# Altium project CMSPanel.PrjPcb
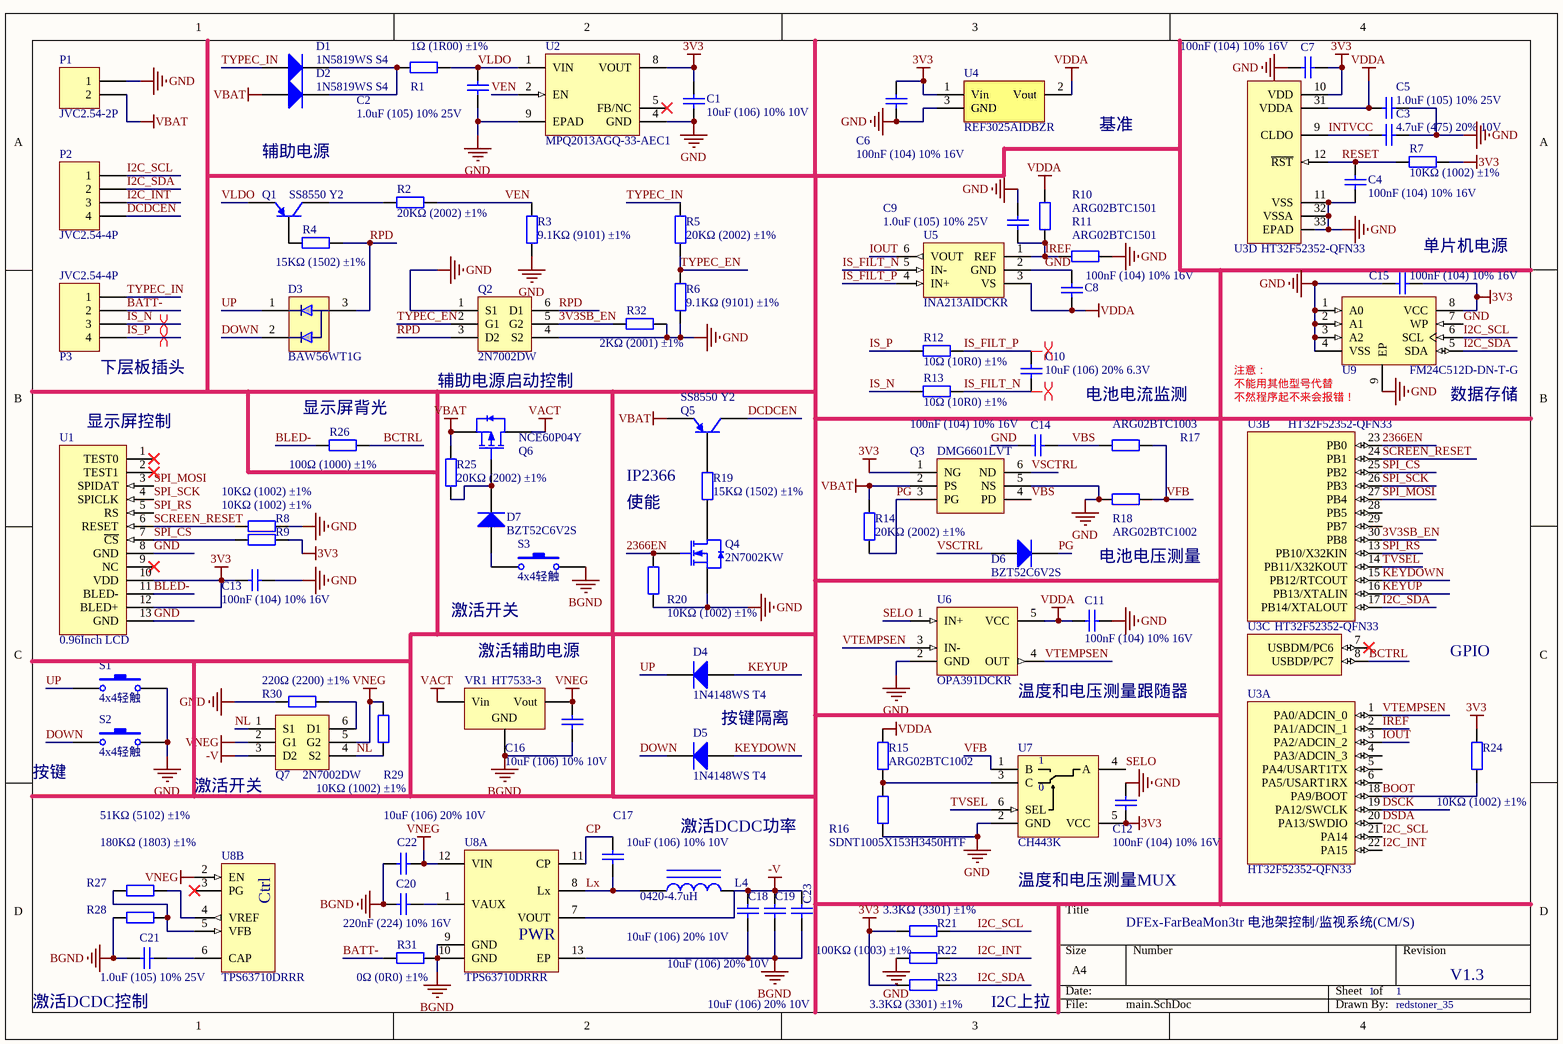
[diagram p0: main.SchDoc]
1 sheet, 86 parts. Net scope: global (net labels, ports and power ports of the same name join across sheets).
Board file: PCB1.PcbDoc

## Sheet main.SchDoc
size A4

### Parts
C1  10uF (106) 10% 10V  [0603_C]
C2  1.0uF (105) 10% 25V  [0402_C]
C3  4.7uF (475) 20% 10V  [0402_C]
C4  100nF (104) 10% 16V  [0402_C]
C5  1.0uF (105) 10% 25V  [0402_C]
C6  100nF (104) 10% 16V  [0402_C]
C7  100nF (104) 10% 16V  [0402_C]
C8  100nF (104) 10% 16V  [0402_C]
C9  1.0uF (105) 10% 25V  [0402_C]
C10  10uF (106) 20% 6.3V  [0402_C]
C11  100nF (104) 10% 16V  [0402_C]
C12  100nF (104) 10% 16V  [0402_C]
C13  100nF (104) 10% 16V  [0402_C]
C14  100nF (104) 10% 16V  [0402_C]
C15  100nF (104) 10% 16V  [0402_C]
C16  10uF (106) 10% 10V  [0603_C]
C17  10uF (106) 10% 10V  [0603_C]
C18  10uF (106) 20% 10V  [0402_C]
C19  10uF (106) 20% 10V  [0402_C]
C20  220nF (224) 10% 16V  [0402_C]
C21  1.0uF (105) 10% 25V  [0402_C]
C22  10uF (106) 20% 10V  [0402_C]
C23  10uF (106) 20% 10V  [0402_C]
D1  1N5819WS S4  [SOD-323]
D2  1N5819WS S4  [SOD-323]
D3  BAW56WT1G  [SC70-3]
D4  1N4148WS T4  [SOD-323]
D5  1N4148WS T4  [SOD-323]
D6  BZT52C6V2S  [SOD-323]
D7  BZT52C6V2S  [SOD-323]
L4  0420-4.7uH  [0420CDMCCDS-***MC]
P1  JVC2.54-2P  [CONN-TH_2P-P2.54_JVC-2.54MM-2P]
P2  JVC2.54-4P  [CONN-TH_4P-P2.54_JVC-2.54MM-4P]
P3  JVC2.54-4P  [CONN-TH_4P-P2.54_JVC-2.54MM-4P]
Q1  SS8550 Y2  [SC70-3]
Q2  2N7002DW  [SC70-6]
Q3  DMG6601LVT  [SOT95P245X110-6N]
Q4  2N7002KW  [SC70-3]
Q5  SS8550 Y2  [SC70-3]
Q6  NCE60P04Y  [SOT-23(SOT-23-3)]
Q7  2N7002DW  [SC70-6]
R1  1Ω (1R00) ±1%  [0402_R]
R2  20KΩ (2002) ±1%  [0402_R]
R3  9.1KΩ (9101) ±1%  [0402_R]
R4  15KΩ (1502) ±1%  [0402_R]
R5  20KΩ (2002) ±1%  [0402_R]
R6  9.1KΩ (9101) ±1%  [0402_R]
R7  10KΩ (1002) ±1%  [0402_R]
R8  10KΩ (1002) ±1%  [0402_R]
R9  10KΩ (1002) ±1%  [0402_R]
R10  ARG02BTC1501  [0402_R]
R11  ARG02BTC1501  [0402_R]
R12  10Ω (10R0) ±1%  [0402_R]
R13  10Ω (10R0) ±1%  [0402_R]
R14  20KΩ (2002) ±1%  [0402_R]
R15  ARG02BTC1002  [0402_R]
R16  SDNT1005X153H3450HTF  [0402_R]
R17  ARG02BTC1003  [0402_R]
R18  ARG02BTC1002  [0402_R]
R19  15KΩ (1502) ±1%  [0402_R]
R20  10KΩ (1002) ±1%  [0402_R]
R21  3.3KΩ (3301) ±1%  [0402_R]
R22  100KΩ (1003) ±1%  [0402_R]
R23  3.3KΩ (3301) ±1%  [0402_R]
R24  10KΩ (1002) ±1%  [0402_R]
R25  20KΩ (2002) ±1%  [0402_R]
R26  100Ω (1000) ±1%  [0402_R]
R27  51KΩ (5102) ±1%  [0402_R]
R28  180KΩ (1803) ±1%  [0402_R]
R29  10KΩ (1002) ±1%  [0402_R]
R30  220Ω (2200) ±1%  [0603_R]
R31  0Ω (0R0) ±1%  [0402_R]
R32  2KΩ (2001) ±1%  [0402_R]
S1  4x4轻触  [SW-SMD_4P-L5.2-W5.2-P3.70-LS6.4]
S2  4x4轻触  [SW-SMD_4P-L5.2-W5.2-P3.70-LS6.4]
S3  4x4轻触  [SW-SMD_4P-L5.2-W5.2-P3.70-LS6.4]
U1  0.96Inch LCD  [0.96"IPS168*80TFT]
U2  MPQ2013AGQ-33-AEC1  [MPQ2013A-QFN8]
U3  HT32F52352-QFN33  [QFN32-HT32]  (parts A,B,C,D of 4)
U4  REF3025AIDBZR  [SOT-23_N]
U5  INA213AIDCKR  [SC70-6]
U6  OPA391DCKR  [SC70-5]
U7  CH443K  [SC70-6]
U8  TPS63710DRRR  [DR0012C]  (parts A,B of 2)
U9  FM24C512D-DN-T-G  [UDFN-8]
VR1  HT7533-3  [SOT-89(SOT-89-3)]

### Nets
3V3: C1.2 C6.2 C7.2 C12.2 C13.1 C15.2 Q3.1(NG) R7.2 R9.2 R21.1 R23.1 R24.2 U1.10(VDD) U1.12(BLED+) U2.8(VOUT) U3.10(VDD) U4.1(Vin) U7.5(VCC) U9.8(VCC)
-V: C18.2 C19.2 C23.2 L4.2 Q7.3(D2) U8.7(VOUT)
BGND: C16.1 C18.1 C19.1 C20.1 C21.1 C22.1 C23.1 R28.1 R31.2 S3.2 U8.9(GND) U8.10(GND) U8.13(EP) VR1.1(GND)
GND: C1.1 C2.1 C3.2 C4.1 C5.2 C6.1 C7.1 C8.2 C9.2 C11.1 C12.1 C13.2 C14.2 C15.1 P1.1 Q2.1(S1) Q2.4(S2) Q3.5(NS) Q4.2(S) R3.1 R6.1 R8.2 R11.1 R16.1 R18.1 R20.1 R22.1 R30.1 R32.2 S1.2 S2.2 U1.8(GND) U1.13(GND) U2.4(GND) U2.9(EPAD) U3.11(VSS) U3.32(VSSA) U3.33(EPAD) U4.3(GND) U5.2(GND) U6.2(GND) U7.2(GND) U9.1(A0) U9.2(A1) U9.3(A2) U9.4(VSS) U9.7(WP) U9.9(EP)
VACT: Q6.3(D) VR1.2(Vin)
VBAT: D2.1(A) P1.2 Q3.2(PS) Q5.2(E) Q6.2(S) R14.2 R25.2
VDDA: C5.1 C8.1 C11.2 R10.2 R15.2 U3.31(VDDA) U4.2(Vout) U5.3(VS) U6.5(VCC)
VNEG: C16.2 C22.2 Q7.2(G1) Q7.5(G2) R29.2 U8.2(EN) U8.12(VIN) VR1.3(Vout)
3V3SB_EN: Q2.5(G2) R32.1 U3.30(PB8)
2366EN: Q4.1(G) R20.2 U3.23(PB0)
BATT-: P3.2 R31.1
BCTRL: R26.1 U3.8(USBDP/PC7)
BLED-: R26.2 U1.11(BLED-)
BOOT: R24.1 U3.18(PA9/BOOT)
CP: C17.2 U8.11(CP)
DCDCEN: P2.4 Q5.3(C)
DOWN: D3.2(K2) D5.2(K) S2.1
DSCK: U3.19(PA12/SWCLK)
DSDA: U3.20(PA13/SWDIO)
I2C_INT: P2.3 R22.2 U3.22(PA15)
I2C_SCL: P2.1 R21.2 U3.21(PA14) U9.6(SCL)
I2C_SDA: P2.2 R23.2 U3.17(PB14/XTALOUT) U9.5(SDA)
INTVCC: C3.1 U3.9(CLDO)
IOUT: U3.3(PA2/ADCIN_2) U5.6(VOUT)
IREF: C9.1 R10.1 R11.2 U3.2(PA1/ADCIN_1) U5.1(REF)
IS_FILT_N: C10.1 R13.2 U5.5(IN-)
IS_FILT_P: C10.2 R12.2 U5.4(IN+)
IS_N: P3.3 R13.1
IS_P: P3.4 R12.1
KEYDOWN: D5.1(A) U3.15(PB12/RTCOUT)
KEYUP: D4.1(A) U3.16(PB13/XTALIN)
Lx: C17.1 L4.1 U8.8(Lx)
NL: Q7.1(S1) Q7.4(S2) R29.1
PG: D6.2(K) Q3.3(PG) R14.1
RESET: C4.2 R7.1 U3.12(~{RST})
RPD: D3.3(A) Q2.3(D2) Q2.6(D1) R4.2
SCREEN_RESET: R8.1 U1.6(RESET) U3.24(PB1)
SELO: U6.1(IN+) U7.4(A)
SPI_CS: R9.1 U1.7(~{CS}) U3.25(PB2)
SPI_MOSI: U1.3(SPIDAT) U3.27(PB4)
SPI_RS: U1.5(RS) U3.13(PB10/X32KIN)
SPI_SCK: U1.4(SPICLK) U3.26(PB3)
TVSEL: U3.14(PB11/X32KOUT) U7.6(SEL)
TYPEC_EN: Q2.2(G1) R5.1 R6.2
TYPEC_IN: D1.1(A) P3.1 R5.2
UP: D3.1(K1) D4.2(K) S1.1
VBS: C14.1 Q3.4(PD) R17.2
VEN: R2.2 R3.2 U2.2(EN)
VFB: R17.1 R18.2 U7.1(B)
VLDO: C2.2 Q1.2(E) R1.2 U2.1(VIN)
VSCTRL: D6.1(A) Q3.6(ND)
VTEMPSEN: U3.1(PA0/ADCIN_0) U6.3(IN-) U6.4(OUT)
NetC20_2: C20.2 U8.1(VAUX)
NetC21_2: C21.2 U8.6(CAP)
NetD1_2: D1.2(K) D2.2(K) R1.1
NetD7_1: D7.1(A) S3.1
NetD7_2: D7.2(K) Q6.1(G) R25.1
NetQ1_1: Q1.1(B) R4.1
NetQ1_3: Q1.3(C) R2.1
NetQ4_3: Q4.3(D) R19.1
NetQ5_1: Q5.1(B) R19.2
NetQ7_6: Q7.6(D1) R30.2
NetR15_1: R15.1 R16.2 U7.3(C)
NetR27_1: R27.1 R28.2 U8.5(VFB)
NetR27_2: R27.2 U8.4(VREF)

Not connected (* = marked no-connect by the designer): U1 1(TEST0)* 2(TEST1)* 9(NC)*; U2 5(FB/NC)*; U3 4(PA3/ADCIN_3) 5(PA4/USART1TX) 6(PA5/USART1RX) 7(USBDM/PC6)* 28(PB5) 29(PB7); U8 3(PG)*

### Layout directives
differential pair: IS_FILT_N, IS_FILT_P, IS_N, IS_P

### Notes on the sheet
- 辅助电源
- 基准
- (near C15) 单片机电源
- (near P3) 下层板插头
- 辅助电源启动控制
- 注意：
- 不能用其他型号代替
- (near U1) 显示屏控制
- (near R26) 显示屏背光
- 电池电流监测
- 不然程序起不来会报错！
- (near U9) 数据存储
- IP2366
- 使能
- 电池电压测量
- 激活开关
- (near VR1) 激活辅助电源
- GPIO
- 按键隔离
- (near U6) 温度和电压测量跟随器
- 按键
- 激活DCDC功率
- 温度和电压测量MUX
- DFEx-FarBeaMon3tr 电池架控制/监视系统(CM/S)
- 1
- V1.3
- 激活DCDC控制
- I2C上拉
- redstoner_35
- (in symbol NC7SB3157P6X) 0
- (in symbol TPS63710DRRR, part A) PWR
- (in symbol TPS63710DRRR, part B) Ctrl

### Library data of the parts
C1 C16 C17 = 0603 10uF (106) 10% 10V: 贴片电容; ComponentLink1Description: 供应商链接; ComponentLink1URL: http://www.szlcsc.com/product/details_20411.html; Package: 0603; Supplier: LC; SuppliersPartNumber: C19702
C2 C5 C9 C21 = 0402 1.0uF (105) 10% 25V: 贴片电容; ComponentLink1Description: 供应商链接; ComponentLink1URL: http://www.szlcsc.com/product/details_53938.html; Package: 0402; Supplier: LC; SuppliersPartNumber: C52923
C3 = 0402 4.7uF (475) 20% 10V: 贴片电容; ComponentLink1Description: 供应商链接; ComponentLink1URL: http://www.szlcsc.com/product/details_24469.html; Package: 0402; Supplier: LC; SuppliersPartNumber: C23733
C4 C6-C8 C11-C15 = 0402 100nF (104) 10% 16V: 贴片电容; ComponentLink1Description: 供应商链接; ComponentLink1URL: http://www.szlcsc.com/product/details_1877.html; Package: 0402; Supplier: LC; SuppliersPartNumber: C1525
C10 C18 C19 C22 C23 = 0402 10uF (106) 20% 6.3V: 贴片电容; ComponentLink1Description: 供应商链接; ComponentLink1URL: http://www.szlcsc.com/product/details_16204.html; Package: 0402; Supplier: LC; SuppliersPartNumber: C15525
C20 = 0402 220nF (224) 10% 16V: 贴片电容; ComponentLink1Description: 供应商链接; ComponentLink1URL: http://www.szlcsc.com/product/details_17456.html; Package: 0402; Supplier: LC; SuppliersPartNumber: C16772
D1 D2 D4 D5 = SOD-323 1N4148WS T4: 二极管; ComponentLink1Description: 供应商链接; ComponentLink1URL: http://www.szlcsc.com/product/details_2485.html; Package: SOD-323; Supplier: LC; SuppliersPartNumber: C2128
D3 = BAW56WT1G: Dual Switching diode,common anode,SOT323-3(SC70-3)
D6 D7 = SOD-323 1N4148WS T4: SOD-323稳压二极管 6.2V稳压电压; ComponentLink1Description: 供应商链接; ComponentLink1URL: http://www.szlcsc.com/product/details_2485.html; Package: SOD-323; Supplier: LC; SuppliersPartNumber: C2128
L4 = Inductor Iron: 一体成型贴片电感 4x4x2mm尺寸   4.7uH电感量; Value: 4.7uH; Published: 24-Mar-1999; LatestRevisionDate: 17-Jul-2002; LatestRevisionNote: Re-released for DXP Platform.; PackageReference: AXIAL-0.9; Publisher: Altium Limited; PackageDescription: Axial Device, Thru-Hole; 2 Leads; 0.9 in Pin Spacing
P1 = CON 2: 2-Pin; LatestRevisionDate: 17-Jul-2002; LatestRevisionNote: Re-released for DXP Platform.; Publisher: Altium Limited
P2 P3 = CON 4: 4-Pin; LatestRevisionDate: 17-Jul-2002; LatestRevisionNote: Re-released for DXP Platform.; Publisher: Altium Limited
Q1 Q5 = SOT-23 SS8550 Y2: PNP三极管，SOT-323 封装; ComponentLink1Description: 供应商链接; ComponentLink1URL: http://www.szlcsc.com/product/details_9037.html; Package: SOT-23; Supplier: LC; SuppliersPartNumber: C8542
Q2 Q7 = 2N7002DW: Dual N-Channel MOSFET 60V340mA SOT-363
Q3 = DMG6601LVT: SOT23-6 N+P Ch. MOSFET
Q4 = 2N7002 7002: MOS(场效应管); ComponentLink1Description: 供应商链接; ComponentLink1URL: http://www.szlcsc.com/product/details_9040.html; Package: SOT-23(SOT-23-3); Supplier: LC; SuppliersPartNumber: C8545
Q6 = SI2301CDS-T1-GE3: MOS(场效应管); ComponentLink1Description: 供应商链接; ComponentLink1URL: http://www.szlcsc.com/product/details_11030.html; Package: SOT-23(SOT-23-3); Supplier: LC; SuppliersPartNumber: C10487
R1 = 0402 1Ω (1R00) 1%: 贴片电阻; ComponentLink1Description: 供应商链接; ComponentLink1URL: http://www.szlcsc.com/product/details_25829.html; Package: 0402; Supplier: LC; SuppliersPartNumber: C25086
R2 R5 R14 R25 = 0402 20KΩ (2002) 1%: 贴片电阻; ComponentLink1Description: 供应商链接; ComponentLink1URL: http://www.szlcsc.com/product/details_26508.html; Package: 0402; Supplier: LC; SuppliersPartNumber: C25765
R3 R6-R9 R20 R24 R29 = 0402 10KΩ (1002) 1%: 贴片电阻; ComponentLink1Description: 供应商链接; ComponentLink1URL: http://www.szlcsc.com/product/details_26487.html; Package: 0402; Supplier: LC; SuppliersPartNumber: C25744
R4 R19 = 0402 15KΩ (1502) 1%: 贴片电阻; ComponentLink1Description: 供应商链接; ComponentLink1URL: http://www.szlcsc.com/product/details_26499.html; Package: 0402; Supplier: LC; SuppliersPartNumber: C25756
R10 R11 = 0402 2KΩ (2001) 1%: 贴片精密电阻，1.5K 0.1% 25PPM; ComponentLink1Description: 供应商链接; ComponentLink1URL: http://www.szlcsc.com/product/details_4516.html; Package: 0402; Supplier: LC; SuppliersPartNumber: C4109
R12 R13 = 0402 10Ω (10R0) 1%: 贴片电阻; ComponentLink1Description: 供应商链接; ComponentLink1URL: http://www.szlcsc.com/product/details_25820.html; Package: 0402; Supplier: LC; SuppliersPartNumber: C25077
R15 R18 = 0402 10KΩ (1002) 1%: 贴片精密电阻，10K 0.1% 25PPM; ComponentLink1Description: 供应商链接; ComponentLink1URL: http://www.szlcsc.com/product/details_26487.html; Package: 0402; Supplier: LC; SuppliersPartNumber: C25744
R16 = 0402 10KΩ (1002) 1%: 贴片热敏电阻 15K@25℃ 1% B值3450; ComponentLink1Description: 供应商链接; ComponentLink1URL: http://www.szlcsc.com/product/details_26487.html; Package: 0402; Supplier: LC; SuppliersPartNumber: C25744
R17 = 0402 100KΩ (1003) 1%: 贴片精密电阻，100K 0.1% 25PPM; ComponentLink1Description: 供应商链接; ComponentLink1URL: http://www.szlcsc.com/product/details_26484.html; Package: 0402; Supplier: LC; SuppliersPartNumber: C25741
R21 R23 = 0402 3.3KΩ (3301) 1%: 贴片电阻; ComponentLink1Description: 供应商链接; ComponentLink1URL: http://www.szlcsc.com/product/details_26633.html; Package: 0402; Supplier: LC; SuppliersPartNumber: C25890
R22 = 0402 100KΩ (1003) 1%: 贴片电阻; ComponentLink1Description: 供应商链接; ComponentLink1URL: http://www.szlcsc.com/product/details_26484.html; Package: 0402; Supplier: LC; SuppliersPartNumber: C25741
R26 = 0402 100Ω (1000) 1%: 贴片电阻; ComponentLink1Description: 供应商链接; ComponentLink1URL: http://www.szlcsc.com/product/details_25819.html; Package: 0402; Supplier: LC; SuppliersPartNumber: C25076
R27 = 0402 51KΩ (5102) 1%: 贴片电阻; ComponentLink1Description: 供应商链接; ComponentLink1URL: http://www.szlcsc.com/product/details_26537.html; Package: 0402; Supplier: LC; SuppliersPartNumber: C25794
R28 = 0402 18KΩ (1802) 1%: 贴片电阻; ComponentLink1Description: 供应商链接; ComponentLink1URL: http://www.szlcsc.com/product/details_26505.html; Package: 0402; Supplier: LC; SuppliersPartNumber: C25762
R30 = 0603 100Ω (1000) 1%: 贴片电阻; ComponentLink1Description: 供应商链接; ComponentLink1URL: http://www.szlcsc.com/product/details_23502.html; Package: 0603; Supplier: LC; SuppliersPartNumber: C22775
R31 = 0402 0Ω (0R0) 1%: 贴片电阻; ComponentLink1Description: 供应商链接; ComponentLink1URL: http://www.szlcsc.com/product/details_17853.html; Package: 0402; Supplier: LC; SuppliersPartNumber: C17168
R32 = 0402 2KΩ (2001) 1%: 贴片电阻; ComponentLink1Description: 供应商链接; ComponentLink1URL: http://www.szlcsc.com/product/details_4516.html; Package: 0402; Supplier: LC; SuppliersPartNumber: C4109
S1-S3 = SW-PB: Switch; pin to pad: 2>3; Published: 24-Mar-1999; LatestRevisionDate: 17-Jul-2002; LatestRevisionNote: Re-released for DXP Platform.; PackageReference: SPST-2; Publisher: Altium Limited; PackageDescription: Switch; 2 Leads
U1 = 0.96Inch LCD: 中景园电子0.96寸TFT LCD,160*80分辨率，IPS材质，ST7735控制器，SPI接口
U2 = MPQ2013AGQ-xx-AEC1: 具有使能引脚的40V耐压MPS LDO,   3.3V固定输出，SON-8(3x3)封装，符合AEC-Q100认证
U3 = HT32F52352-QFN: Holtek MCU Cortex M0+ 48MHz 128K ROM 16K RAM
U4 = REF2930: '50PPM/℃ 25mA最大输出能力 2.5V固定电压串联基准芯片，SOT23-3封装
U5 = INA199A2DCKR: 50倍增益 26V共模范围高精度检流放大器，SC70-6封装
U6 = LMV321IDCKR: CMOS超小型单路轨到轨精密运算放  大器，45uV失调电压，SC70-5
U7 = NC7SB3157P6X: Low-Voltage Analog Switch SPDT,1.8-5V Power
U8 = TPS63710DRRR: TI电压反相器，SON12封装
U9 = CAT24C512HU5: 512Kbit(64K*8)I2C接口EEPROM，带有唯一ID和安全扇区 UDFN-8(2x3)
VR1 = SOT-89 HT7550-1: 低压差线性稳压(LDO); ComponentLink1Description: 供应商链接; ComponentLink1URL: http://www.szlcsc.com/product/details_16788.html; Package: SOT-89; Supplier: LC; SuppliersPartNumber: C16106